# Altium schematic sheet Linear array.SchDoc
size A; SheetNumber: 3; SheetTotal: 6
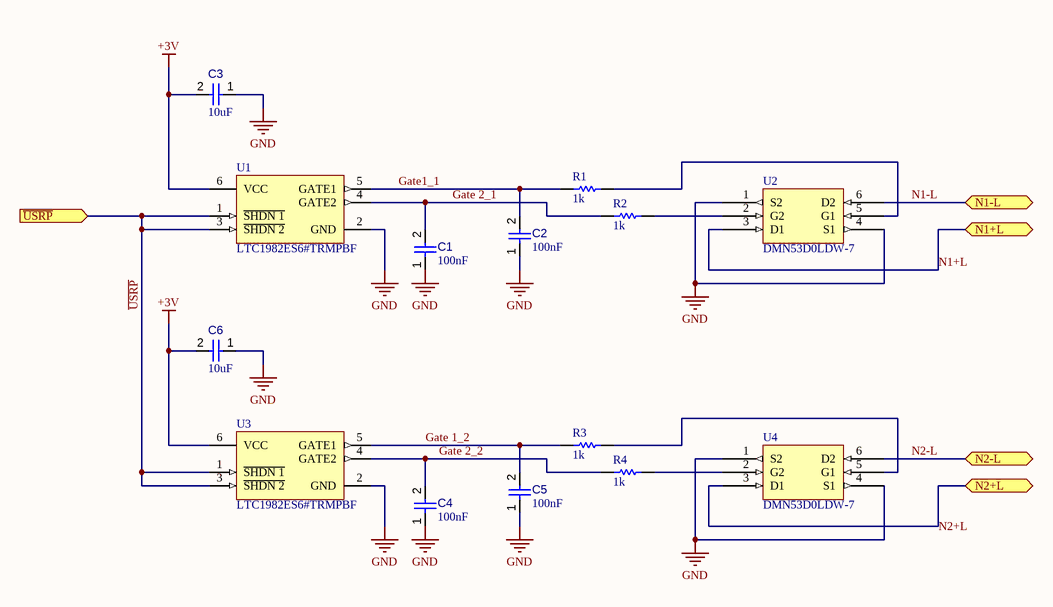
[diagram p0: Linear array.SchDoc]

## Parts
C1  value 100nF  [CAPC1608X90X40NL10T20]  (hidden comment: Capacitor 100 nF +/-10% 50 V 0603)
C2  value 100nF  [CAPC1608X90X40NL10T20]  (hidden comment: Capacitor 100 nF +/-10% 50 V 0603)
C3  value 10uF  [CAPC1608X90X40NL10T20]  (hidden comment: Capacitor 100 nF +/-10% 50 V 0603)
C4  value 100nF  [CAPC1608X90X40NL10T20]  (hidden comment: Capacitor 100 nF +/-10% 50 V 0603)
C5  value 100nF  [CAPC1608X90X40NL10T20]  (hidden comment: Capacitor 100 nF +/-10% 50 V 0603)
C6  value 10uF  [CAPC1608X90X40NL10T20]  (hidden comment: Capacitor 100 nF +/-10% 50 V 0603)
R1  value 1k  (hidden comment: Resistor)
R2  value 1k  (hidden comment: Resistor)
R3  value 1k  (hidden comment: Resistor)
R4  value 1k  (hidden comment: Resistor)
U1  LTC1982ES6#TRMPBF  [LT-S6-6-SOT-23_M]
U2  DMN53D0LDW-7  [SOT95P285X130-6N]
U3  LTC1982ES6#TRMPBF  [LT-S6-6-SOT-23_M]
U4  DMN53D0LDW-7  [SOT95P285X130-6N]

## Ports
N1+L (bidir), N1-L (bidir), N2+L (bidir), N2-L (bidir), ~{USRP} (in)

## Nets
+3V: C3.2 C6.2 U1.6(VCC) U3.6(VCC)
GND: C1.1 C2.1 C3.1 C4.1 C5.1 C6.1 U1.2(GND) U2.1(S2) U2.4(S1) U3.2(GND) U4.1(S2) U4.4(S1)
~{USRP}: U1.1(~{SHDN_1}) U1.3(~{SHDN_2}) U3.1(~{SHDN_1}) U3.3(~{SHDN_2}) ; port ~{USRP}
Gate1_1: C2.2 R1.2 U1.5(GATE1)
Gate 1_2: C5.2 R3.2 U3.5(GATE1)
Gate 2_1: C1.2 R2.2 U1.4(GATE2)
Gate 2_2: C4.2 R4.2 U3.4(GATE2)
N1+L: U2.3(D1) ; port N1+L
N1-L: U2.6(D2) ; port N1-L
N2+L: U4.3(D1) ; port N2+L
N2-L: U4.6(D2) ; port N2-L
NetR1_1: R1.1 U2.5(G1)
NetR2_1: R2.1 U2.2(G2)
NetR3_1: R3.1 U4.5(G1)
NetR4_1: R4.1 U4.2(G2)

## Library data of the parts
C1-C6 = CMP-001-00017-6: Chip Capacitor, 100 nF, +/- 10%, 50 V, 0603 (1608 Metric); Voltage Rating: 50V; Capacitor Type: Ceramic; Tolerance: 10%; Mounting Technology: SM; Max Operating Temperature: 125°C; RoHS Compliant: True; Pins: 2; Case/Package: 0603; Min Operating Temperature: -55°C
R1-R4 = Resistor: TC1: 0; SimulationGenericComponent: True; TC2: 0
U1 U3 = CMP-0479-00421-1: Single and Dual Micropower High Side Switch Controller, 1.8 to 5.5 V Vin, 6-pin SOT23 (S6-6), -40 to 85 degC, Pb-Free, Mini Tape and Reel; Manufacturer: Linear Technology; ComponentLink2Description: Datasheet; RoHS: TRUE; ComponentLink1URL: http://www.linear.com/; ComponentLink1Description: Manufacturer URL; PackageDescription: 6-Pin Plastic SOT-23, Body 1.625 x 2.9 mm, Pitch 0.95 mm; ComponentLink3URL: http://cds.linear.com/docs/en/datasheet/175435f.pdf; ComponentLink2URL: http://cds.linear.com/docs/en/datasheet/19812fs.pdf; PackageVersion: Aug-07; ComponentLink3Description: Package Specification; PackageReference: S6-6; Packing: Mini Tape and Reel; PartNumber: LTC1982ES6#TRMPBF; Mounting Technology: Surface Mount
U2 U4 = CMP-0000-1: Transistor MOSFET Array Dual N-CH 50V 360mA 3-Pin SOT-363 T/R